# EasyEDA Pro project ProPrj_STM32音响_2025-06-08.epro, board PCB4
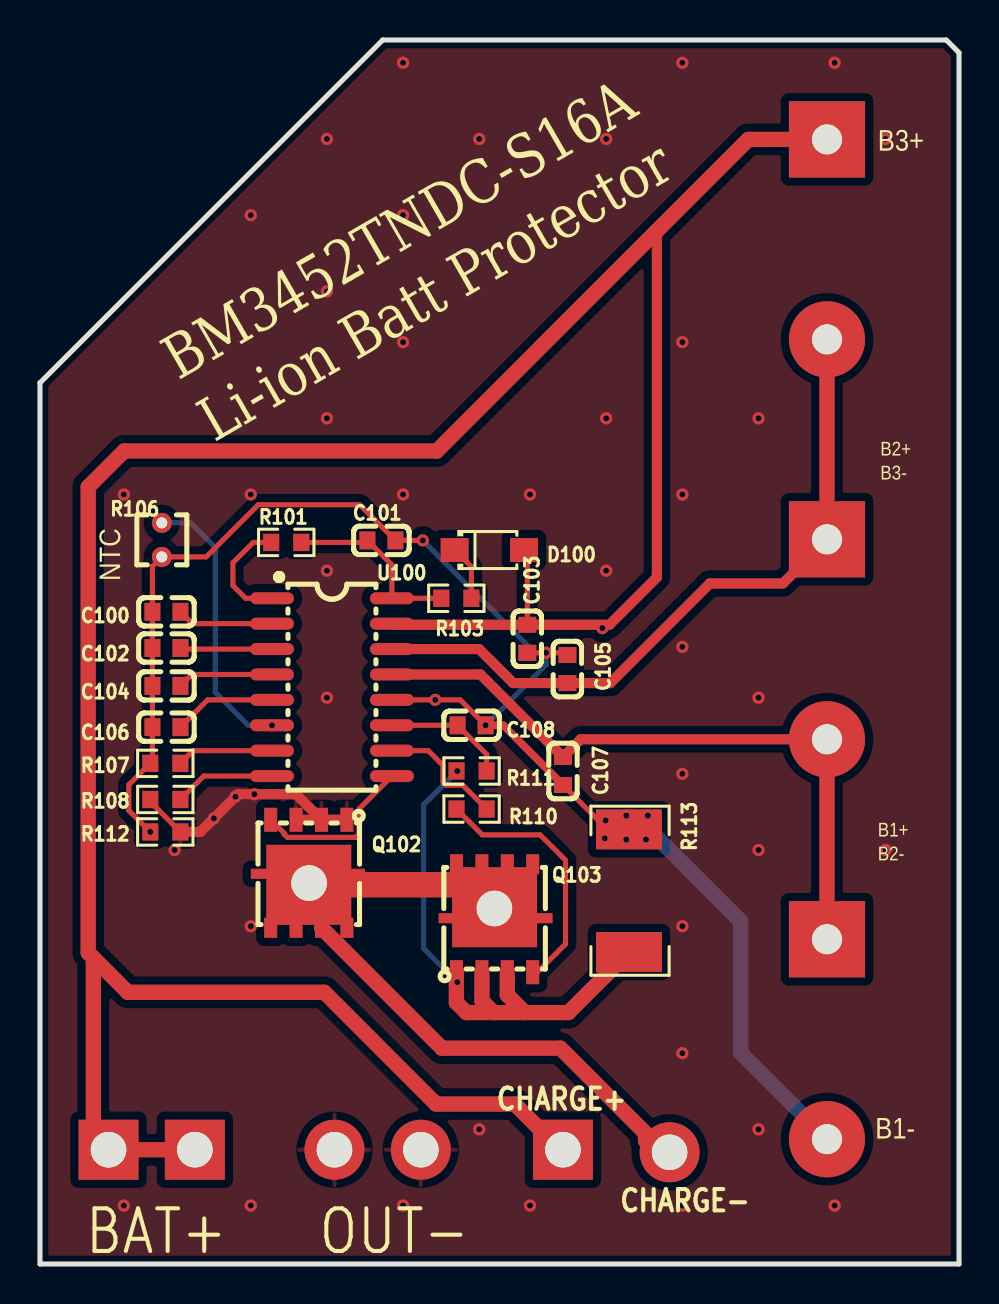
[diagram p19: board, top side]
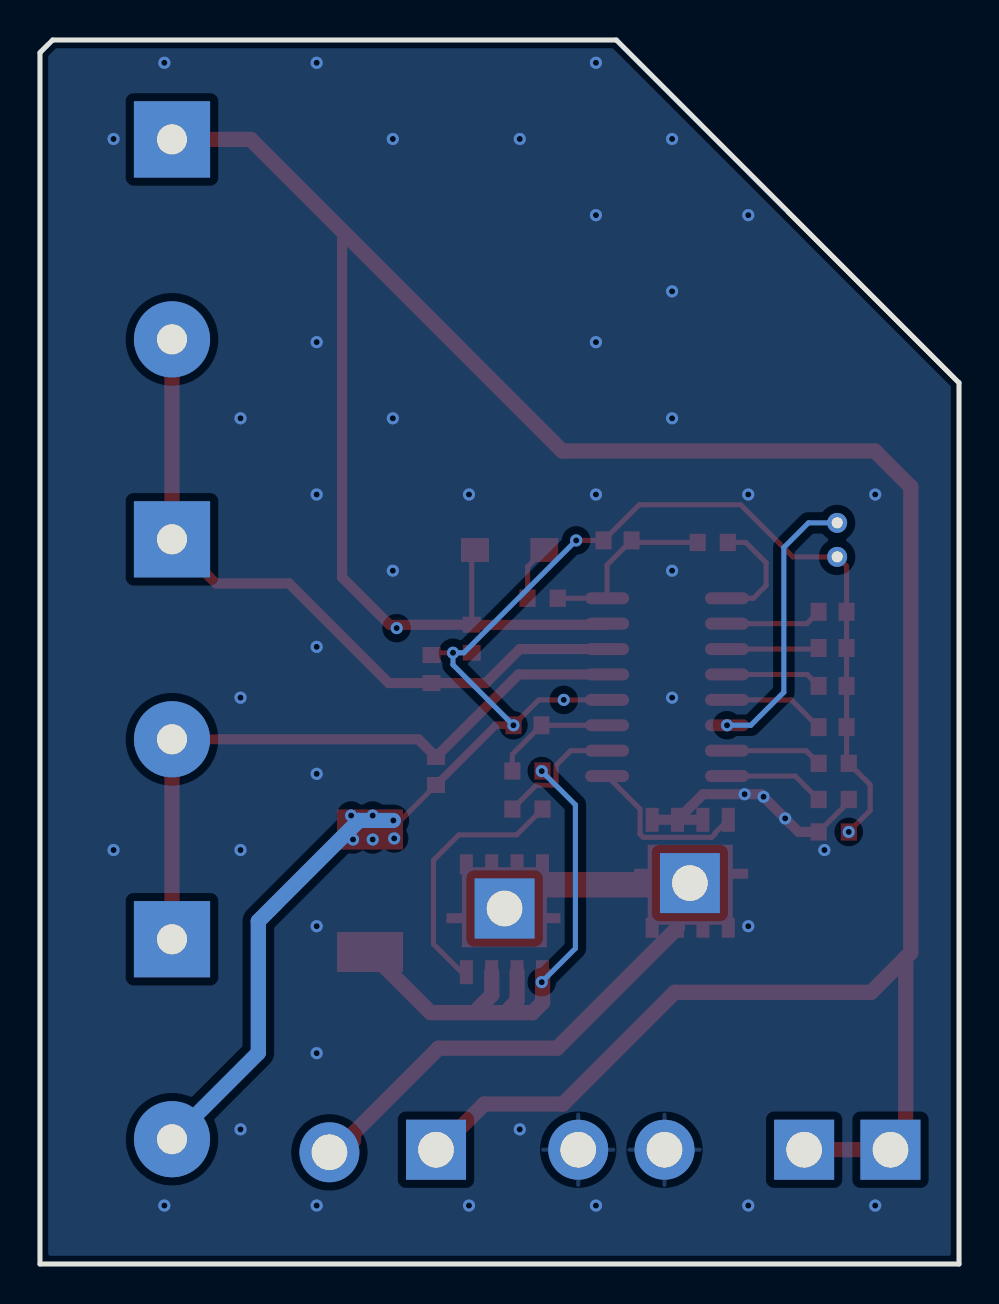
[diagram p20: board, bottom side, seen from below]

Outline 45.97 x 61.21 mm; copper layers: Top Layer, Bottom Layer. Coordinates in mm from the lower left corner of the outline.
Outline path: 0,44.07 0,0 45.97,0 45.97,60.58 45.34,61.21 17.14,61.21 0,44.07
Stack: Top Layer 0.035mm / Dielectric1 1.51mm FR4 er 4.5 / Bottom Layer 0.035mm

## Design rules (mm)
template: JLCPCB Capability(Two Layers Board)
spacing copperThickness1oz (default): track to track 0.102, other pairs 0.152 to 0.3
spacing copperThickness2oz: track to track 0.203, other pairs 0.152 to 0.3
track width copperThickness1oz (default): min 0.127, default 0.254, max 2.54
track width copperThickness2oz: min 0.203, default 0.254, max 2.54
differential pair differentialPair (default): width min 0.127, default 0.254, max 2.54; gap min 0.152, default 0.152
via viaSize (default): diameter min 0.5, default 0.61, max 10; hole min 0.3, default 0.305, max 6.3

## Placement (name value [footprint] x y rotation side)
C100  100nF  [C0603]  6.32 32.62 0 top
C101  1uF  [C0603]  17.08 36.19 0 top
C102  100nF  [C0603]  6.32 30.81 0 top
C103  100nF  [C0603]  24.38 31.27 90 top
C104  100nF  [C0603]  6.32 28.91 0 top
C105  100nF  [C0603]  26.38 29.75 270 top
C106  100nF  [C0603]  6.32 26.85 0 top
C107  100nF  [C0603]  26.16 24.66 270 top
C108  100nF  [C0603]  21.59 26.94 180 top
D100  1N4007W  [SOD-123FL_L2.7-W1.8-LS3.8-RD]  22.48 35.71 0 top
NOREF  -  [Pad_e430]  7.75 5.72 0 top
NOREF#2  -  [Pad_e261]  39.37 26.24 0 top
NOREF#3  -  [Pad_e457]  19.05 5.72 0 top
NOREF#4  -  [Pad_e449]  26.16 5.72 0 top
NOREF#5  -  [Pad_e434]  14.73 5.72 0 top
NOREF#6  -  [Pad_e450]  31.5 5.59 0 top
NOREF#7  -  [Pad_e357]  13.46 19.05 0 top
NOREF#8  -  [Pad_e262]  39.37 36.24 0 top
NOREF#9  -  [Pad_e429]  3.43 5.72 0 top
NOREF#10  -  [Pad_e258]  39.37 6.24 0 top
NOREF#11  -  [Pad_e260]  39.37 16.24 0 top
NOREF#12  -  [Pad_e264]  39.37 56.24 0 top
NOREF#13  -  [Pad_e263]  39.37 46.24 0 top
NOREF#14  -  [Pad_e355]  22.73 17.78 0 top
Q102  TPH2R306NH,L1Q  [DFN-8_L5.0-W5.0-P1.27-LS6.0-EP]  13.4 19.52 180 top
Q103  TPH2R306NH,L1Q  [DFN-8_L5.0-W5.0-P1.27-LS6.0-EP]  22.79 17.29 0 top
R101  1MΩ  [R0603]  12.32 36.09 0 top
R103  1kΩ  [R0603]  20.83 33.29 0 top
R106  MF52A103F3950 (A1)  [RES-TH_L2.5-W2.5-P1.70-D0.3]  6.1 36.21 90 top
R107  6.8kΩ  [R0603]  6.27 25.04 0 top
R108  220kΩ  [R0603]  6.27 23.23 0 top
R110  2kΩ  [R0603]  21.59 22.75 0 top
R111  2kΩ  [R0603]  21.59 24.66 0 top
R112  10MΩ  [R0603]  6.27 21.61 180 top
R113  15mΩ  [RES-SMD_L6.4-W3.2-R2512]  29.46 18.67 270 top
U100  -  [SOP-16_L10.3-W4.4-P1.27-LS7.0-BL]  14.61 28.85 270 top

## Footprints (pads in the part's own frame, mm; a bottom-side part is the same pattern mirrored in y, then rotated)
C0603
  rect 0.8x0.9 smd: 1(-0.7,0) 2(0.7,0)
DFN-8_L5.0-W5.0-P1.27-LS6.0-EP
  rect 0.65x1.2 smd: 1(-1.955,-2.7) 2(-0.685,-2.7) 3(0.585,-2.7) 4(1.855,-2.7)
  rect 0.65x1 smd: 5(1.855,2.7) 6(0.585,2.7) 7(-0.685,2.7) 8(-1.955,2.7)
  rect 1x0.5 smd: 8(-2.35,0.001) 8(2.35,0.001)
  rect 4.25x4 smd: 8(-0.05,0.55)
Pad_e258
  round 3.81 hole 1.5: 1(0,0)
Pad_e260
  rect 3.81x3.81 hole 1.5: 1(0,0)
Pad_e261
  round 3.81 hole 1.5: 1(0,0)
Pad_e262
  rect 3.81x3.81 hole 1.5: 1(0,0)
Pad_e263
  round 3.81 hole 1.5: 1(0,0)
Pad_e264
  rect 3.81x3.81 hole 1.5: 1(0,0)
Pad_e355
  rect 3x3 hole 1.778: 1(0,0)
Pad_e357
  rect 3x3 hole 1.778: 1(0,0)
Pad_e429
  rect 3x3 hole 1.778: 1(0,0)
Pad_e430
  rect 3x3 hole 1.778: 1(0,0)
Pad_e434
  round 3 hole 1.778: 1(0,0)
Pad_e449
  rect 3x3 hole 1.778: 1(0,0)
Pad_e450
  round 3 hole 1.778: 1(0,0)
Pad_e457
  round 3 hole 1.778: 1(0,0)
R0603
  rect 0.806x0.864 smd: 1(-0.753,0) 2(0.753,0)
RES-SMD_L6.4-W3.2-R2512
  rect 2x3.3 smd: 1(-3.067,0) 2(3.067,0)
RES-TH_L2.5-W2.5-P1.70-D0.3
  round 1 hole 0.55: 1(-0.85,0) 2(0.85,0)
SOD-123FL_L2.7-W1.8-LS3.8-RD
  rect 1.4x1.2 smd: 1(-1.735,0) 2(1.735,0)
SOP-16_L10.3-W4.4-P1.27-LS7.0-BL
  oval 0.6x2.2 smd: 1(-4.445,-3) 2(-3.175,-3) 3(-1.905,-3) 4(-0.635,-3) 5(0.635,-3) 6(1.905,-3) 7(3.175,-3) 8(4.445,-3) 9(4.445,3) 10(3.175,3) 11(1.905,3) 12(0.635,3) 13(-0.635,3) 14(-1.905,3) 15(-3.175,3) 16(-4.445,3)

## Nets
GND: NOREF#3.1 NOREF#5.1 Q102.1 Q102.2 Q102.3 R108.1 R112.1
BAT1+: C107.1 NOREF#2.1 NOREF#11.1 U100.13
BAT1-: C100.1 C101.2 C102.1 C103.1 C104.1 C105.1 C106.1 C107.2 C108.1 NOREF#10.1 R106.1 R107.1 R112.2 R113.1 U100.12
BAT2+: C105.2 NOREF#8.1 NOREF#13.1 U100.14
BAT+: C103.2 D100.2 NOREF.1 NOREF#4.1 NOREF#9.1 NOREF#12.1 U100.15
CHARGE-: NOREF#6.1 NOREF#7.1 NOREF#14.1 Q102.5 Q102.6 Q102.7 Q102.8 Q103.5 Q103.6 Q103.7 Q103.8
$1N1279: D100.1 R103.2
$1N1280: C100.2 U100.2
$1N1281: R101.1 U100.1
$1N1282: C101.1 R101.2 R103.1 U100.16
$1N1286: C102.2 U100.3
$1N1287: C104.2 U100.4
$1N1288: C106.2 U100.5
$1N1289: R106.2 U100.6
$1N1290: R107.2 U100.7
$1N1291: R108.2 U100.8
$1N1294: R110.2 U100.10
$1N1295: C108.2 R111.2 U100.11
$1N1536: Q103.1 Q103.2 Q103.3 R111.1 R113.2
$1N1538: Q103.4 R110.1
$1N1542: Q102.4 U100.9

## Via types
v1: diameter 0.61, hole 0.305, Top Layer to Bottom Layer, 58 vias

## Routing (per net, layer and track width the routed paths; a pad name or vN(x,y) marks a point on that pad's centre or on a via; arc(x,y) is an arc through that point)
GND: length 13.2
  Top Layer w0.254: R112.1 5.52,23.12 R108.1
  Top Layer w0.508: R112.1 8.02,21.61 v1(8.7,22.29) v1(9.78,23.37) 9.91,23.5 v1(10.73,23.5) 12.8,23.5 Q102.2 ; Q102.2 Q102.1 ; Q102.2 Q102.3
  vias: v1(4.19,38.48) v1(4.19,2.92) v1(6.73,20.7) v1(10.54,52.45) v1(10.54,38.48) v1(10.54,16.89) v1(10.54,2.92) v1(14.35,56.26) v1(14.35,48.64) v1(14.35,42.29) v1(14.35,34.67) v1(14.35,28.32) v1(18.16,60.07) v1(18.16,52.45) v1(18.16,46.1) v1(18.16,38.48) v1(18.16,2.92) v1(21.97,56.26) v1(21.97,6.73) v1(24.51,38.48) v1(24.51,2.92) v1(28.32,56.26) v1(28.32,42.29) v1(28.32,34.67) v1(32.13,60.07) v1(32.13,46.1) v1(32.13,38.48) v1(32.13,30.86) v1(32.13,24.51) v1(32.13,16.89) v1(32.13,10.54) v1(32.13,2.92) v1(35.94,42.29) v1(35.94,28.32) v1(35.94,20.7) v1(35.94,6.73) v1(39.75,60.07) v1(39.75,2.92) v1(42.29,56.26) v1(42.29,20.7)
BAT1+: length 33.8
  Top Layer w0.508: NOREF#2.1 27.05,26.24 C107.1 22.04,29.48 U100.13
  Top Layer w0.762: 39.37,26.05 39.37,16.05
BAT1-: length 79.9
  Top Layer w0.254: 19.15,36.19 C101.2 15.99,37.97 10.92,37.97 8.31,35.36 R106.1 5.62,34.89 C100.1 C102.1 C104.1 C106.1 5.62,25.15 R107.1 ; 5.51,25.04 4.45,23.97 4.45,22.68 v1(5.52,21.61) ; C107.2 27.94,22.18 v1(28.3,22.18) ; v1(22.29,26.94) 21.02,28.21 v1(19.77,28.21) U100.12 ; C105.1 26.27,30.57 v1(25.31,30.57) C103.1
  Top Layer w0.381: v1(22.29,26.94) 23.18,26.94 C107.2
  Bottom Layer w0.254: v1(19.15,36.19) 24.77,30.57 v1(25.31,30.57) 25.31,29.97 v1(22.29,26.94)
  Bottom Layer w0.762: v1(28.3,22.18) 30.02,22.18 35.05,17.15 35.05,10.56 NOREF#10.1
  vias: v1(28.26,21.28) v1(29.33,22.43) v1(29.33,21.23) v1(30.32,21.23) v1(30.41,22.43)
BAT2+: length 35.4
  Top Layer w0.508: NOREF#8.1 37.16,34.04 33.51,34.04 28.53,29.05 C105.2 23.67,29.05 21.97,30.75 U100.14
  Top Layer w0.762: NOREF#13.1 NOREF#8.1
BAT+: length 144.5
  Top Layer w0.254: C103.2 24.38,35.54 D100.2
  Top Layer w0.508: 30.86,51.67 30.86,34.34 28.49,31.97 C103.2 17.66,31.97 U100.15
  Top Layer w0.762: 2.67,15.32 4.39,13.59 14.22,13.59 19.81,8 23.75,8 25.84,5.91 ; 2.67,15.32 2.41,15.57 2.41,38.86 4.21,40.66 19.85,40.66 35.43,56.24 NOREF#12.1 ; 2.67,15.32 2.67,6.48 NOREF#9.1 NOREF.1
  vias: v1(28.13,31.8)
CHARGE-: length 30.6
  Top Layer w0.762: 30.29,6.16 30.29,6.54 26.04,10.8 20.1,10.8 Q102.7
  Top Layer w1.27: Q103.8 21.62,18.97 Q102.8
$1N1279: length 2.8
  Top Layer w0.254: R103.2 21.58,34.87 D100.1
$1N1280: length 4.8
  Top Layer w0.254: C100.2 7.62,32.02 U100.2
$1N1281: length 5.7
  Top Layer w0.254: R101.1 10.67,36.09 9.65,35.07 9.65,33.93 10.29,33.29 U100.1
$1N1282: length 9.2
  Top Layer w0.254: R101.2 16.28,36.09 C101.1 17.61,34.96 U100.16 R103.1
$1N1286: length 4.6
  Top Layer w0.254: C102.2 7.08,30.75 U100.3
$1N1287: length 4.8
  Top Layer w0.254: C104.2 7.6,29.48 U100.4
$1N1288: length 5.1
  Top Layer w0.254: U100.5 8.39,28.21 C106.2
$1N1289: length 13.9
  Bottom Layer w0.254: R106.2 7.53,37.06 8.76,35.83 8.76,28.59 10.41,26.94 v1(11.61,26.94)
$1N1290: length 4.8
  Top Layer w0.254: U100.7 7.66,25.67 R107.2
$1N1291: length 5.1
  Top Layer w0.254: U100.8 8.19,24.4 R108.2
$1N1294: length 6.4
  Top Layer w0.254: U100.10 19.42,25.67 20.15,24.94 20.15,24.11 20.32,23.95 21.15,23.95 R110.2
$1N1295: length 6.2
  Top Layer w0.254: U100.11 C108.2 22.34,25.49 R111.2
$1N1536: length 28.2
  Top Layer w0.762: 24.26,12.57 26.43,12.57 R113.2 ; 24.26,12.57 23.38,13.45 Q103.3 ; 24.26,12.57 22.7,12.57 ; Q103.1 20.83,14.58 20.83,13.08 21.34,12.57 22.7,12.57 ; Q103.2 22.11,13.16 22.7,12.57
  Bottom Layer w0.254: v1(20.88,14.1) 19.19,15.78 19.19,22.96 v1(20.88,24.65)
$1N1538: length 12.9
  Top Layer w0.254: Q103.4 24.88,14.59 26.29,16 26.29,20.19 25.02,21.46 22.13,21.46 R110.1
$1N1542: length 8.5
  Top Layer w0.254: U100.9 15.96,22.75 15.96,21.5 15.79,21.34 12.37,21.34 12.21,21.5 12.21,21.55 Q102.4

## Copper pours and planes (outline as drawn; the poured copper is in the pictures)
GND on Top Layer: 45.34,61.21 17.14,61.21 0,44.07 0,0 45.97,0 45.97,60.58
GND on Bottom Layer: 45.21,61.34 17.02,61.34 -0.13,44.2 -0.13,0.13 45.85,0.13 45.85,60.71

## Text on the board
Top Silkscreen Layer: CHARGE+ | CHARGE- | BAT+ | OUT- | BM3452TNDC-S16A / Li-ion Batt Protector | B1+ / B2- | B2+ / B3- | B1- | B3+ | NTC
